# Altium schematic sheet Power Supply.SchDoc: Power Supply
size A4; DrawnBy: P.Z.P; Revision: 0.0.1; SheetNumber: 2; SheetTotal: 3
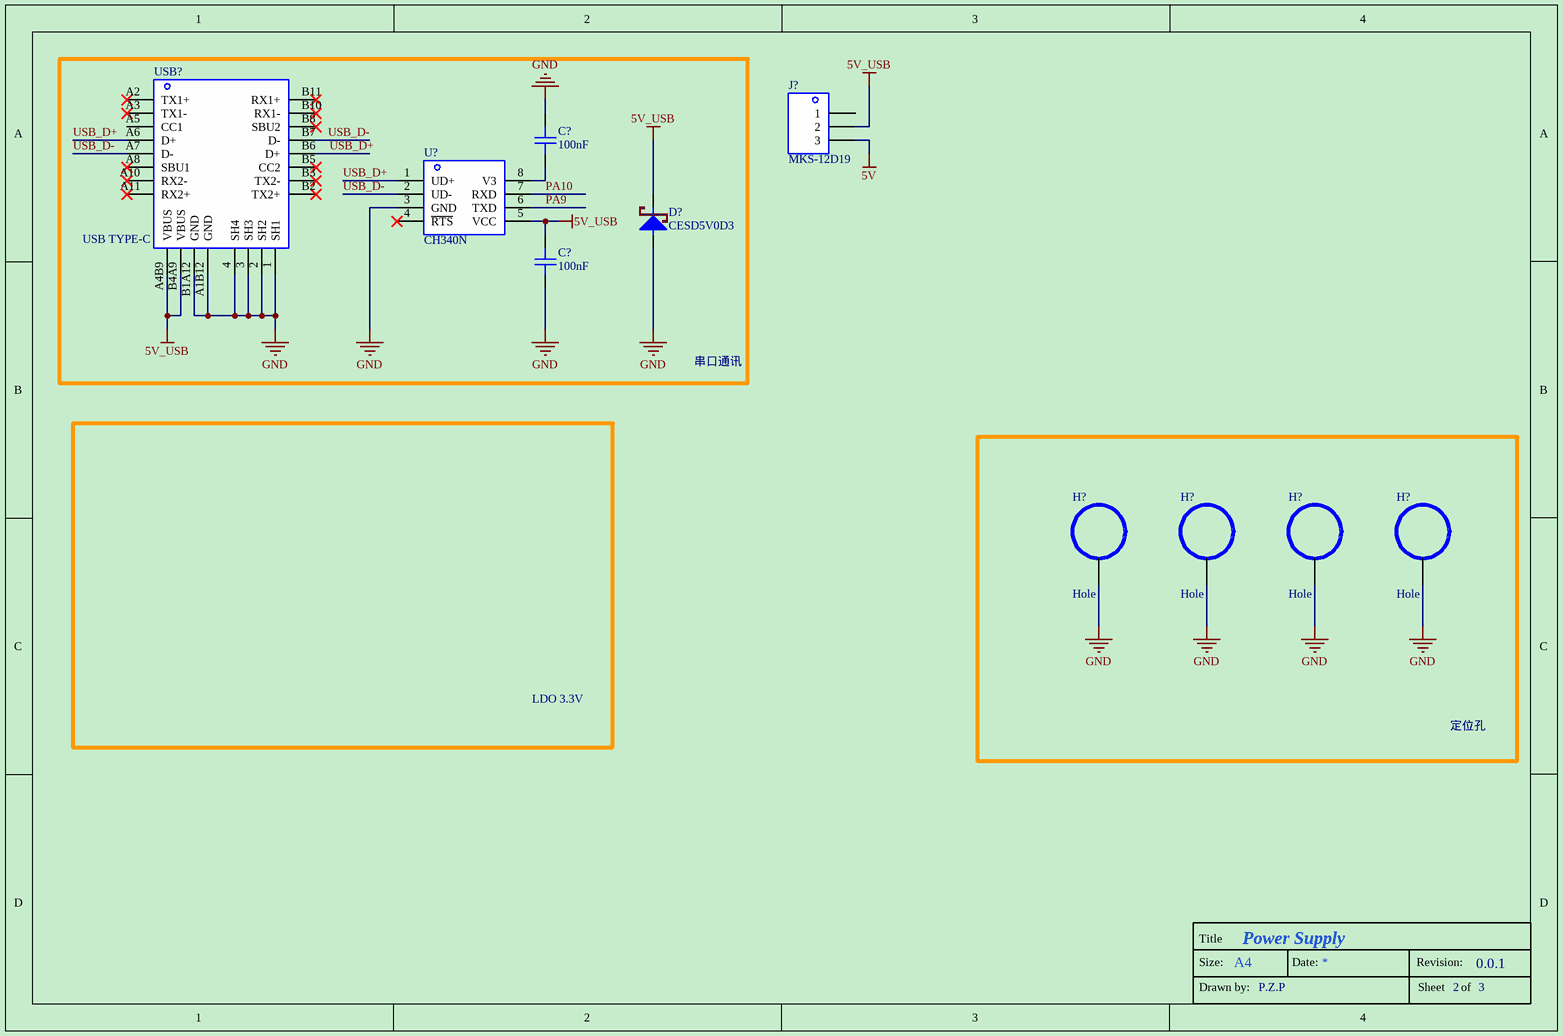
[diagram p0: Power Supply.SchDoc]

## Parts
(Parts that share a designator on the sheet are numbered #1, #2 ... from top to bottom, then left to right.)
C?#1  100nF  [0603L]
C?#2  100nF  [0603L]
D?  CESD5V0D3  [0603L]
H?#1  Hole  [Hole]
H?#2  Hole  [Hole]
H?#3  Hole  [Hole]
H?#4  Hole  [Hole]
J?  MKS-12D19  [MSK-12D19]
U?  CH340N
USB?  USB TYPE-C

## Blocks framed on the sheet
串口通讯: C?#1 C?#2 D? U? USB?
定位孔: H?#1-H?#4

## Nets
5V: J?.3
5V_USB: C?#2.1 D?.2(K) J?.2 U?.5(VCC) USB?.A4B9(VBUS) USB?.B4A9(VBUS)
GND: C?#1.2 C?#2.2 D?.1(A) H?#1.1 H?#2.1 H?#3.1 H?#4.1 U?.3(GND) USB?.1(SH1) USB?.2(SH2) USB?.3(SH3) USB?.4(SH4) USB?.A1B12(GND) USB?.B1A12(GND)
PA9: U?.6(TXD)
PA10: U?.7(RXD)
USB_D+: U?.1(UD+) USB?.A6(D+) USB?.B6(D+)
USB_D-: U?.2(UD-) USB?.A7(D-) USB?.B7(D-)
NetC?#1_1: C?#1.1 U?.8(V3)

Not connected (* = marked no-connect by the designer): J? 1; U? 4(~{RTS})*; USB? A2(TX1+)* A3(TX1-)* A5(CC1) A8(SBU1)* A10(RX2-)* A11(RX2+)* B2(TX2+)* B3(TX2-)* B5(CC2)* B8(SBU2)* B10(RX1-)* B11(RX1+)*

## Notes on the sheet
- LDO 3.3V
- Title
- Size:
- Drawn by:
- A4
- Date:
- Revision:
- Sheet
- of

## Library data of the parts
C?#1 C?#2 = Cap1: 无级电容; value: 100nF
D? = TVS: 瞬态二极管
H?#1-H?#4 = Hole: 定位孔
J? = SW1: 拨动开关